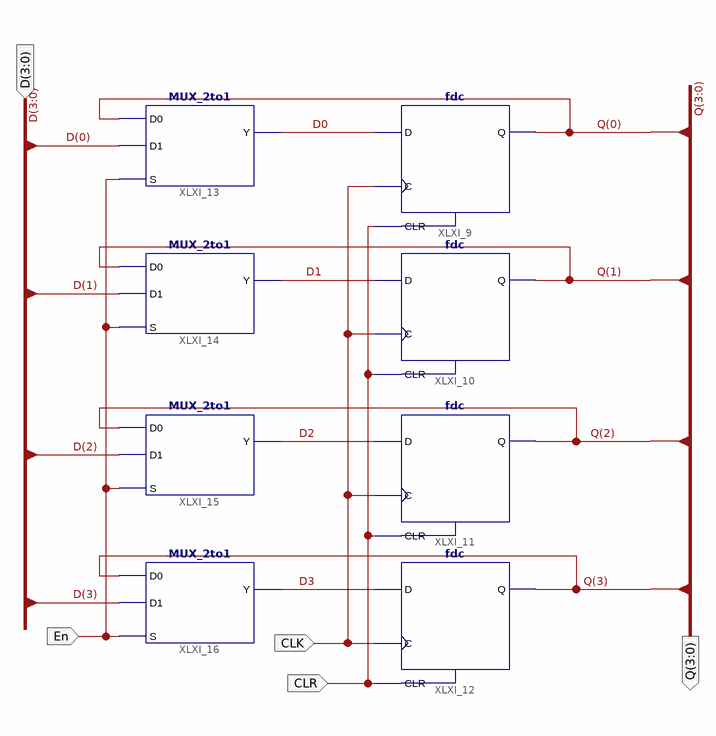
[diagram p0: schematic sheet 1]
// Xilinx ISE schematic Register_4Bit.sch (spartan3e) as structural Verilog: 8 symbols, 5 ports
module Register_4Bit (
  input  CLR,
  input  CLK,
  input  En,
  input  [3:0] D,
  output [3:0] Q
);

  wire D0, D1, D2, D3;

  fdc XLXI_9 (.C(CLK), .CLR(CLR), .D(D0), .Q(Q[0]));
  fdc XLXI_10 (.C(CLK), .CLR(CLR), .D(D1), .Q(Q[1]));
  fdc XLXI_11 (.C(CLK), .CLR(CLR), .D(D2), .Q(Q[2]));
  fdc XLXI_12 (.C(CLK), .CLR(CLR), .D(D3), .Q(Q[3]));
  MUX_2to1 XLXI_13 (.D0(Q[0]), .S(En), .D1(D[0]), .Y(D0));
  MUX_2to1 XLXI_14 (.D0(Q[1]), .S(En), .D1(D[1]), .Y(D1));
  MUX_2to1 XLXI_15 (.D0(Q[2]), .S(En), .D1(D[2]), .Y(D2));
  MUX_2to1 XLXI_16 (.D0(Q[3]), .S(En), .D1(D[3]), .Y(D3));
endmodule
